# Altium schematic sheet 仿真器.SchDoc
size A4
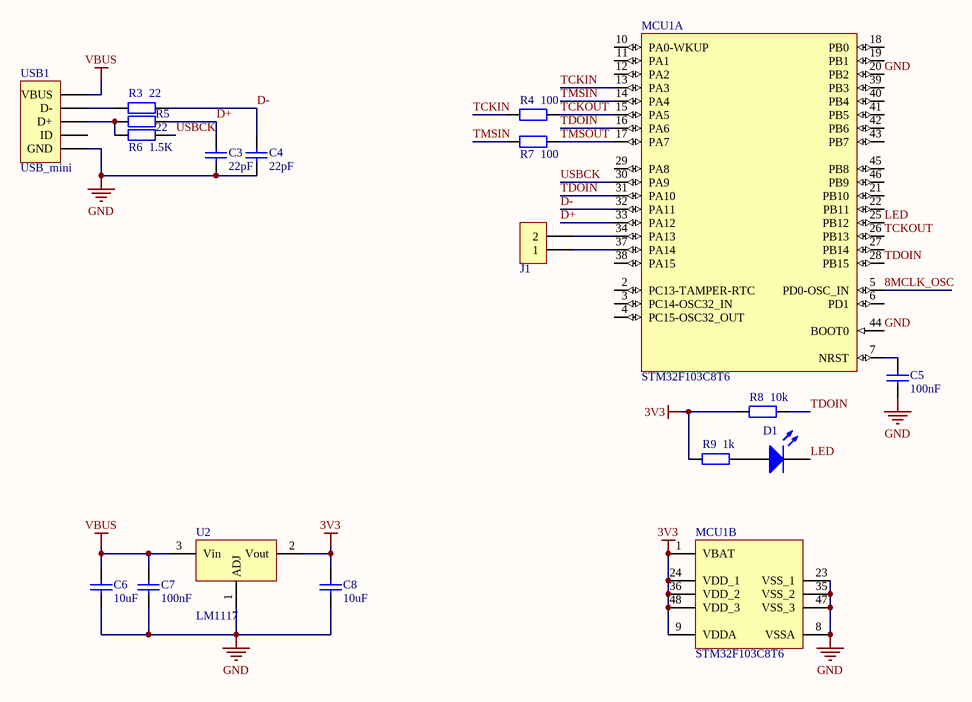
[diagram p0: 仿真器.SchDoc]

## Parts
C3  22pF  [0805]
C4  22pF  [0805]
C5  100nF  [0805]
C6  10uF  [0805]
C7  100nF  [0805]
C8  10uF  [0805]
D1  LED0  [0805]  (value not drawn)
J1  CON2  [0603]  (value not drawn)
MCU1  STM32F103C8T6  [LQLFP48]  (parts A,B of 2)
R3  22  [0805]
R4  100  [0805]
R5  22  [0805]
R6  1.5K  [0805]
R7  100  [0805]
R8  10k  [0805]
R9  1k  [0805]
U2  LM1117  [SOT223_L]
USB1  USB_mini  [USB-MICRO]

## Nets
3V3: C8.1 MCU1.1(VBAT) MCU1.9(VDDA) MCU1.24(VDD_1) MCU1.36(VDD_2) MCU1.48(VDD_3) R8.2 R9.2 U2.2(Vout)
GND: C3.1 C4.1 C5.2 C6.2 C7.1 C8.2 MCU1.8(VSSA) MCU1.20(PB2) MCU1.23(VSS_1) MCU1.35(VSS_2) MCU1.44(BOOT0) MCU1.47(VSS_3) U2.1(ADJ) USB1.5(GND)
VBUS: C6.1 C7.2 U2.3(Vin) USB1.1(VBUS)
8MCLK_OSC: MCU1.5(PD0-OSC_IN)
D+: C3.2 MCU1.33(PA12) R5.2
D-: C4.2 MCU1.32(PA11) R3.2
LED: D1.2(K) MCU1.25(PB12)
TCKIN: MCU1.13(PA3) R4.1
TCKOUT: MCU1.15(PA5) MCU1.26(PB13) R4.2
TDOIN: MCU1.16(PA6) MCU1.28(PB15) MCU1.31(PA10) R8.1
TMSIN: MCU1.14(PA4) R7.1
TMSOUT: MCU1.17(PA7) R7.2
USBCK: MCU1.30(PA9) R6.2
NetC5_1: C5.1 MCU1.7(NRST)
NetD1_1: D1.1(A) R9.1
NetJ1_1: J1.1 MCU1.37(PA14)
NetJ1_2: J1.2 MCU1.34(PA13)
NetR3_1: R3.1 USB1.2(D-)
NetR5_1: R5.1 R6.1 USB1.3(D+)

Not connected (* = marked no-connect by the designer): MCU1 2(PC13-TAMPER-RTC) 3(PC14-OSC32_IN) 4(PC15-OSC32_OUT) 6(PD1) 10(PA0-WKUP) 11(PA1) 12(PA2) 18(PB0) 19(PB1) 21(PB10) 22(PB11) 27(PB14) 29(PA8) 38(PA15) 39(PB3) 40(PB4) 41(PB5) 42(PB6) 43(PB7) 45(PB8) 46(PB9); USB1 4(ID)

## Library data of the parts
C3-C8 = Cap: Capacitor; Value: 100pF; Published: 8-Jun-2000; LatestRevisionDate: 17-Jul-2002; LatestRevisionNote: Re-released for DXP Platform.; PackageReference: RAD-0.3; Publisher: Altium Limited; PackageDescription: Radial Cap, Thru-Hole; 2 Leads; 0.3 in Pin Spacing
D1 = LED0: Typical INFRARED GaAs LED; Published: 8-Jun-2000; LatestRevisionDate: 08-Jul-2005; LatestRevisionNote: Mech Layer 1 removed.; PackageReference: LED-0; Publisher: Altium Limited; PackageDescription: LED; 2 Leads
J1 = CON2: Connector
MCU1 = STM32F103C8T6: STM32 ARM-based 32-bit MCU Performance Line with 64 kB Flash, 20 kB Internal RAM, -40 to +85癈 Temperature, 48-Pin LQFP, Tray; DatasheetVersion: rev13.0, Apr-2011; PackageVersion: rev13, Apr-2011; PackageReference: LQFP48; PackageDescription: 48-Pin Low-Profile Quad Flat Pack, 7 x 7 mm Body, 0.5 mm Pitch (LQFP48); ComponentLink1Description: Manufacturer URL; ComponentLink1URL: http://www.st.com/; ComponentLink2Description: STM32F103 Datasheet; ComponentLink2URL: http://www.st.com/internet/com/TECHNICAL_RESOURCES/TECHNICAL_LITERATURE/DATASHEET/CD00161566.pdf; ComponentLink3Description: STM32 Family Web Page; ComponentLink3URL: www.st.com/stm32
R3-R8 = Res2: Resistor; Value: 1K; Published: 8-Jun-2000; LatestRevisionDate: 17-Jul-2002; LatestRevisionNote: Re-released for DXP Platform.; PackageReference: AXIAL-0.4; Publisher: Altium Limited; PackageDescription: Axial Device, Thru-Hole; 2 Leads; 0.4 in Pin Spacing
R9 = Res2: Resistor; Published: 8-Jun-2000; LatestRevisionDate: 17-Jul-2002; LatestRevisionNote: Re-released for DXP Platform.; PackageReference: AXIAL-0.4; Publisher: Altium Limited; PackageDescription: Axial Device, Thru-Hole; 2 Leads; 0.4 in Pin Spacing; Value: 1K
U2 = LM1117: 正三端稳压器
USB1 = USB_mini: Connector